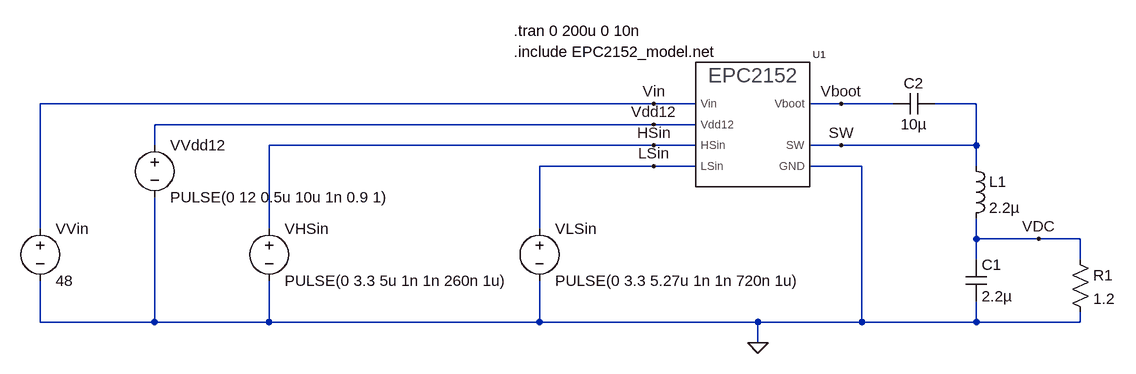
[diagram p0: schematic EPC2152_sim.asc]
EPC2152_sim.asc, the LTspice schematic file:
Version 4
SHEET 1 1452 680
WIRE 736 -80 -208 -80
WIRE 800 -80 736 -80
WIRE 1024 -80 976 -80
WIRE 1104 -80 1024 -80
WIRE 1232 -80 1168 -80
WIRE 736 -48 -32 -48
WIRE 800 -48 736 -48
WIRE -32 -16 -32 -48
WIRE 736 -16 144 -16
WIRE 800 -16 736 -16
WIRE 1024 -16 976 -16
WIRE 1232 -16 1232 -80
WIRE 1232 -16 1024 -16
WIRE 736 16 560 16
WIRE 800 16 736 16
WIRE 1056 16 976 16
WIRE 1232 16 1232 -16
WIRE -208 112 -208 -80
WIRE 144 112 144 -16
WIRE 560 112 560 16
WIRE 1232 128 1232 96
WIRE 1328 128 1232 128
WIRE 1392 128 1328 128
WIRE 1232 160 1232 128
WIRE 1392 160 1392 128
WIRE -208 256 -208 192
WIRE -32 256 -32 64
WIRE -32 256 -208 256
WIRE 144 256 144 192
WIRE 144 256 -32 256
WIRE 560 256 560 192
WIRE 560 256 144 256
WIRE 896 256 560 256
WIRE 1056 256 1056 16
WIRE 1056 256 896 256
WIRE 1232 256 1232 224
WIRE 1232 256 1056 256
WIRE 1392 256 1392 240
WIRE 1392 256 1232 256
WIRE 896 288 896 256
FLAG 896 288 0
FLAG 1024 -16 SW
FLAG 1024 -80 Vboot
FLAG 1328 128 VDC
FLAG 736 -16 HSin
FLAG 736 16 LSin
FLAG 736 -48 Vdd12
FLAG 736 -80 Vin
SYMBOL voltage 144 96 R0
WINDOW 123 0 0 Left 0
WINDOW 39 0 0 Left 0
SYMATTR InstName VHSin
SYMATTR Value PULSE(0 3.3 5u 1n 1n 260n 1u)
SYMBOL EPC2152 800 48 R0
SYMATTR InstName U1
SYMATTR Prefix X
SYMATTR Value EPC2152_model
SYMBOL voltage 560 96 R0
WINDOW 123 0 0 Left 0
WINDOW 39 0 0 Left 0
SYMATTR InstName VLSin
SYMATTR Value PULSE(0 3.3 5.27u 1n 1n 720n 1u)
SYMBOL ind 1216 0 R0
SYMATTR InstName L1
SYMATTR Value 2.2µ
SYMATTR SpiceLine Ipk=25.6 Rser=0.0082 Rpar=0 Cpar=0 mfg="Vishay" pn="IHLP4040DZ01-2R2"
SYMBOL res 1376 144 R0
SYMATTR InstName R1
SYMATTR Value 1.2
SYMBOL cap 1216 160 R0
SYMATTR InstName C1
SYMATTR Value 2.2µ
SYMBOL cap 1168 -96 R90
WINDOW 0 0 32 VBottom 2
WINDOW 3 32 32 VTop 2
SYMATTR InstName C2
SYMATTR Value 10µ
SYMBOL voltage -32 -32 R0
WINDOW 123 0 0 Left 0
WINDOW 39 0 0 Left 0
SYMATTR InstName VVdd12
SYMATTR Value PULSE(0 12 0.5u 10u 1n 0.9 1)
SYMBOL voltage -208 96 R0
WINDOW 123 0 0 Left 0
WINDOW 39 0 0 Left 0
SYMATTR InstName VVin
SYMATTR Value 48
TEXT 520 -192 Left 2 !.tran 0 200u 0 10n
TEXT 520 -160 Left 2 !.include EPC2152_model.net

The netlist it stands for:
* EPC2152_sim.asc
VHSin HSin 0 PULSE(0 3.3 5u 1n 1n 260n 1u)
XU1 HSin LSin SW Vboot Vdd12 Vin 0 EPC2152 params: EPC2152_model  ; pins HSin LSin SW Vboot Vdd12 Vin GND
VLSin LSin 0 PULSE(0 3.3 5.27u 1n 1n 720n 1u)
L1 SW VDC 2.2µ Ipk=25.6 Rser=0.0082 Rpar=0 Cpar=0 mfg="Vishay" pn="IHLP4040DZ01-2R2"
R1 VDC 0 1.2
C1 VDC 0 2.2µ
C2 SW Vboot 10µ
VVdd12 Vdd12 0 PULSE(0 12 0.5u 10u 1n 0.9 1)
VVin Vin 0 48
.tran 0 200u 0 10n
.include EPC2152_model.net
.backanno
.end